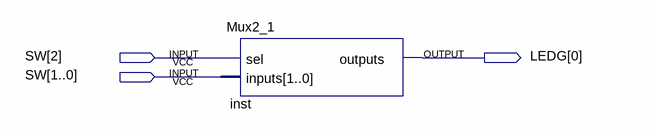
[diagram p0: schematic sheet]
// Quartus schematic Mux2_1Demo.bdf as structural Verilog: 1 symbols, 3 pins
module Mux2_1Demo (
  input  [2:0] SW,
  output [0:0] LEDG
);

  Mux2_1 inst (.sel(SW[2]), .inputs(SW[1:0]), .outputs(LEDG[0]));
endmodule
